# EAGLE design wifistation (EAGLE 9.6.2)
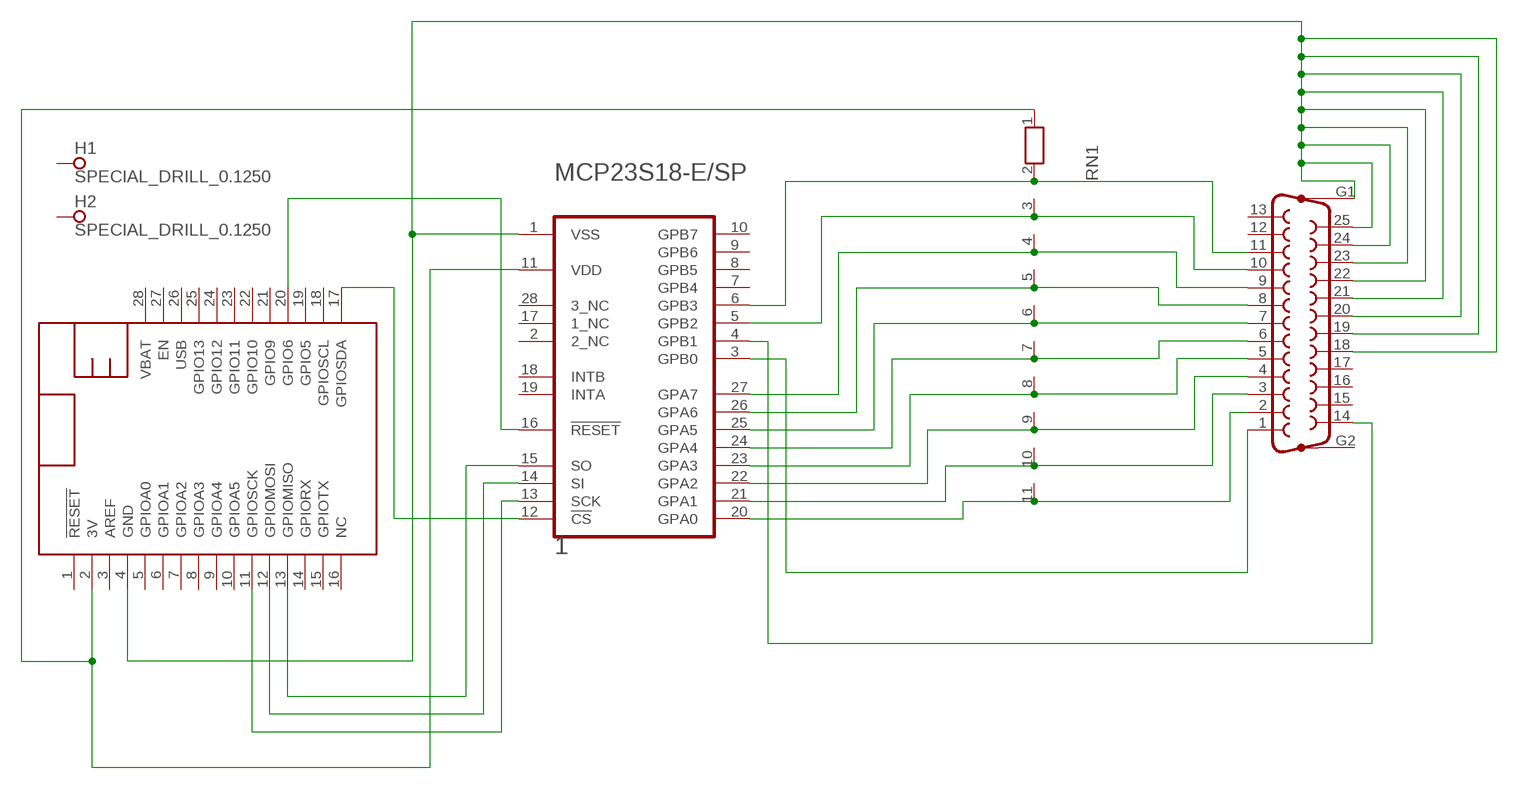
[diagram p0: schematic, sheet 1]

## Parts
1  MICROCHIP_MCP23S18-E-SPMICROCHIP_MCP23S18-E-SP_0_0  [MICROCHIP_MCP23S18-E-SP_0]
DB25  F25HP  [F25HP]
FEATHER  FEATHERWING_NODIM_NOHOLES  [FEATHERWING_DIM]
H1  SPECIAL_DRILL_0.1250  [PAD_0.1250]
H2  SPECIAL_DRILL_0.1250  [PAD_0.1250]
RN1  RN10  [RN-11]

## Nets
3V: 1.11(VDD) FEATHER.2(3V) RN1.1
ACK: 1.5(GPB2) DB25.10 RN1.3
BUSY: 1.6(GPB3) DB25.11 RN1.2
DATA0: 1.20(GPA0) DB25.2 RN1.11
DATA1: 1.21(GPA1) DB25.3 RN1.10
DATA2: 1.22(GPA2) DB25.4 RN1.9
DATA3: 1.23(GPA3) DB25.5 RN1.8
DATA4: 1.24(GPA4) DB25.6 RN1.7
DATA5: 1.25(GPA5) DB25.7 RN1.6
DATA6: 1.26(GPA6) DB25.8 RN1.5
DATA7: 1.27(GPA7) DB25.9 RN1.4
LINEFEED: 1.4(GPB1) DB25.14
N$1: 1.1(VSS) DB25.18 DB25.19 DB25.20 DB25.21 DB25.22 DB25.23 DB25.24 DB25.25 DB25.G1 FEATHER.4(GND)
N$2: 1.15(SO) FEATHER.13(GPIOMISO)
N$3: 1.16(!RESET!) FEATHER.20(GPIO6)
N$4: 1.14(SI) FEATHER.12(GPIOMOSI)
N$5: 1.13(SCK) FEATHER.11(GPIOSCK)
N$6: 1.12(!CS!) FEATHER.17(GPIOSDA)
STROBE: 1.3(GPB0) DB25.1
Unconnected: 1.2(2_NC) 1.7(GPB4) 1.8(GPB5) 1.9(GPB6) 1.10(GPB7) 1.17(1_NC) 1.18(INTB) 1.19(INTA) 1.28(3_NC) DB25.12 DB25.13 DB25.15 DB25.16 DB25.17 DB25.G2 FEATHER.1(!RESET) FEATHER.3(AREF) FEATHER.5(GPIOA0) FEATHER.6(GPIOA1) FEATHER.7(GPIOA2) FEATHER.8(GPIOA3) FEATHER.9(GPIOA4) FEATHER.10(GPIOA5) FEATHER.14(GPIORX) FEATHER.15(GPIOTX) FEATHER.16(NC) FEATHER.18(GPIOSCL) FEATHER.19(GPIO5) FEATHER.21(GPIO9) FEATHER.22(GPIO10) FEATHER.23(GPIO11) FEATHER.24(GPIO12) FEATHER.25(GPIO13) FEATHER.26(USB) FEATHER.27(EN) FEATHER.28(VBAT) H1.1 H2.1

## Library data of the parts
1 = SP:MICROCHIP_MCP23S18-E-SP: PR-BUSIC-MCP23S18-28; CIIVA_IDS: 1159082; COMPONENT_LINK_1_DESCRIPTION: Manufacturer URL; COMPONENT_LINK_1_URL: http://www.microchip.com/; COMPONENT_LINK_3_DESCRIPTION: Package Specification; COMPONENT_LINK_3_URL: http://www.microchip.com/stellent/groups/techpub_sg/documents/packagingspec/en012702.pdf; DATASHEET: http://ww1.microchip.com/downloads/en/DeviceDoc/22103a.pdf; DATASHEET_VERSION: revA, Sep-2008; FOOTPRINT_VARIANT_NAME_0: Manufacturer Recommended; IMPORTED: yes; IMPORTED_FROM: vault; IMPORT_TS: 1521846449; MF: Microchip; MPN: MCP23S18-E/SP; PACKAGE: SPDIP300-SP28; PACKAGE_DESCRIPTION: 28-Lead Skinny Plastic Dual In-Line (SP) - 300 mil Body [SPDIP]; PACKAGE_VERSION: revBB, Aug-2009; PREFIX: U; RELEASE_DATE: 1331953635; VAULT_GUID: 2D1A82E6-0393-4C19-9A39-33F9A78E4054; VAULT_REVISION: BF821639-BD4A-4B78-8582-77FD07E24365
DB25 = jcs:F25HP: SUB-D; OC_FARNELL: unknown; OC_NEWARK: unknown
FEATHER = jcs:FEATHERWING
H1 H2 = special-drill:SPECIAL_DRILL_: Special drills
RN1 = resistor-net:RN10: RESISTOR NETWORK; OC_FARNELL: unknown; OC_NEWARK: unknown

## Board
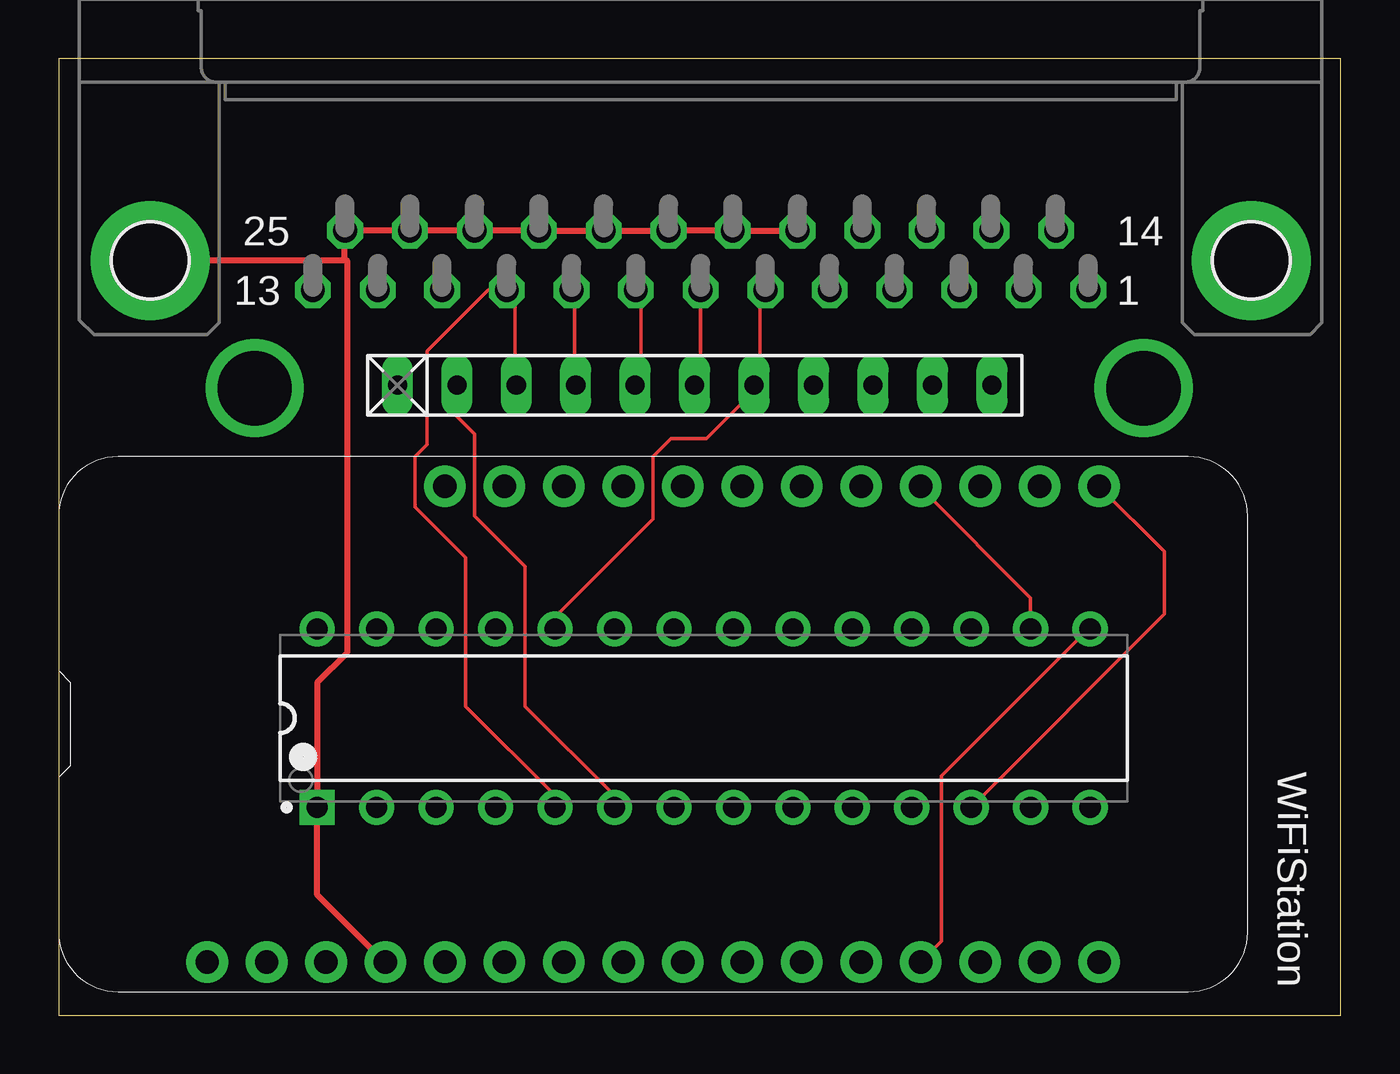
[diagram p1: board, top side]
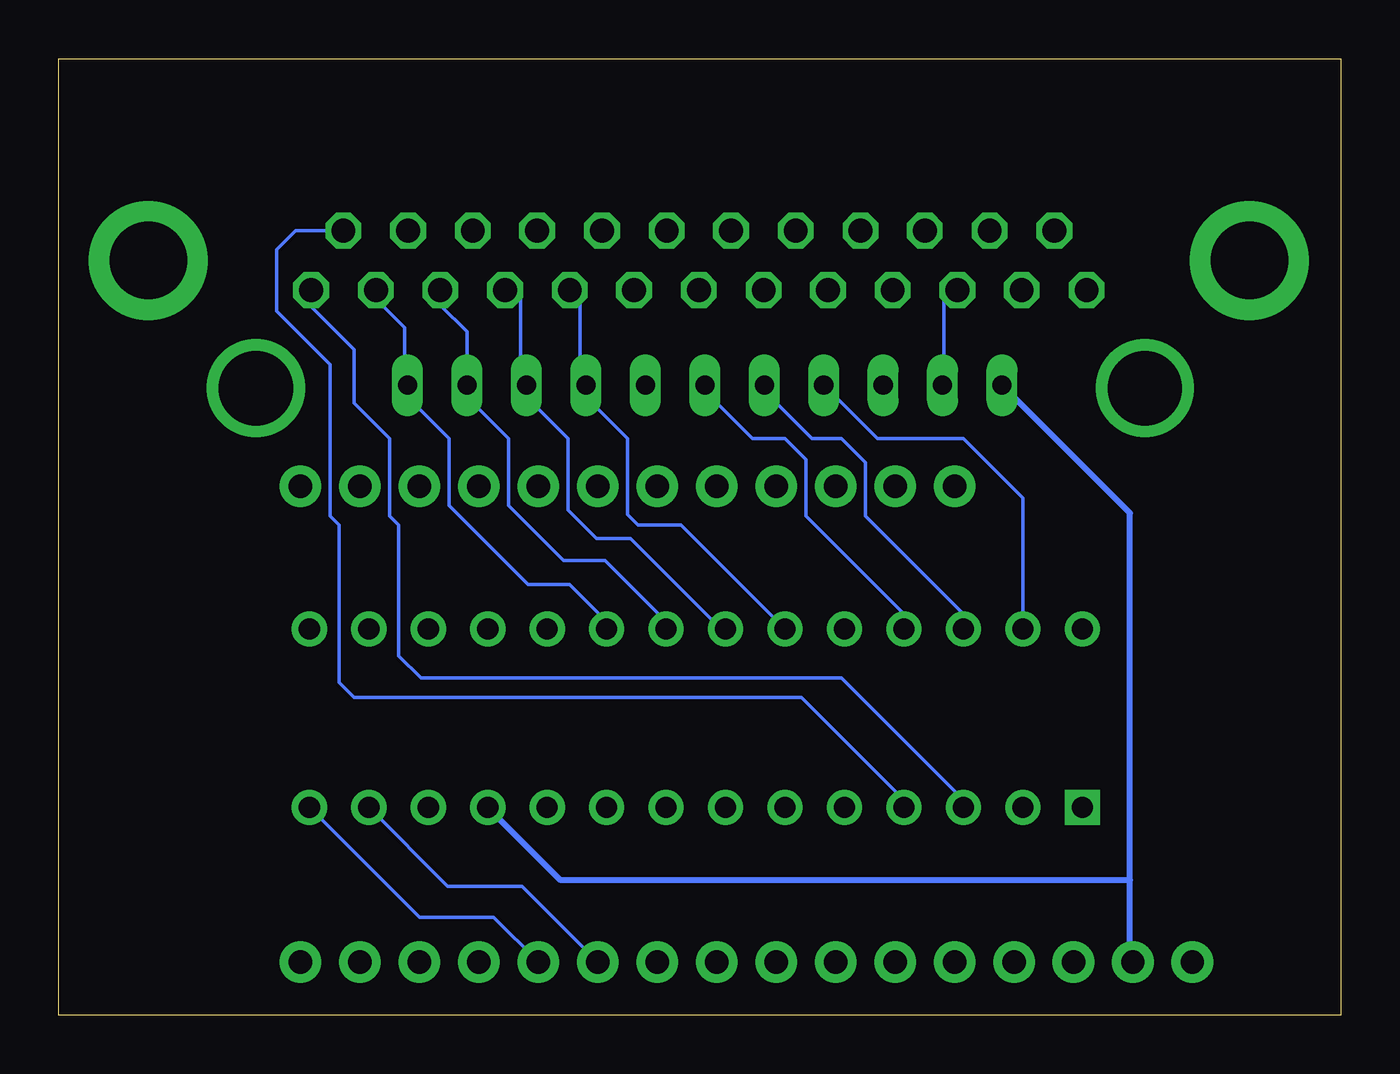
[diagram p2: board, bottom side, seen from below]

Size 54.79 x 40.88 mm. Coordinates in mm from the lower left corner, seen from the top.
Outline: 0,0 54.79,0 54.79,40.88 0,40.88 0,0
Copper layers (1*16): Top 0.035mm / dielectric 1.5mm / Bottom 0.035mm
Design rules "default": minimum track width 6mil, minimum drill 0.35mm, track to track 6mil, track to pad 6mil, pad to pad 6mil, via to via 6mil, smd to smd 6mil, copper to edge 40mil, drill to drill 6mil, minimum pad ring 10mil, minimum via ring 8mil, stop-mask expansion 4mil, vias tented up to drill 0mil, thermal gap 10mil

### Footprints (pad centres in the part's own frame; a part is rotated, then mirrored left to right if it is on the bottom)
MICROCHIP_MCP23S18-E-SP_0 = drill 0.9 pad 1.5 square: 1 -3.81,16.51 | drill 0.9 pad 1.5: 2 -3.81,13.97; 3 -3.81,11.43; 4 -3.81,8.89; 5 -3.81,6.35; 6 -3.81,3.81; 7 -3.81,1.27; 8 -3.81,-1.27; 9 -3.81,-3.81; 10 -3.81,-6.35; 11 -3.81,-8.89; 12 -3.81,-11.43; 13 -3.81,-13.97; 14 -3.81,-16.51; 15 3.81,-16.51; 16 3.81,-13.97; 17 3.81,-11.43; 18 3.81,-8.89; 19 3.81,-6.35; 20 3.81,-3.81; 21 3.81,-1.27; 22 3.81,1.27; 23 3.81,3.81; 24 3.81,6.35; 25 3.81,8.89; 26 3.81,11.43; 27 3.81,13.97; 28 3.81,16.51
F25HP = drill 1.016 octagon: 1 16.561,-1.27; 2 13.792,-1.27; 3 11.049,-1.27; 4 8.28,-1.27; 5 5.512,-1.27; 6 2.769,-1.27; 7 0,-1.27; 8 -2.769,-1.27; 9 -5.512,-1.27; 10 -8.28,-1.27; 11 -11.049,-1.27; 12 -13.792,-1.27; 13 -16.561,-1.27; 14 15.189,1.27; 15 12.421,1.27; 16 9.652,1.27; 17 6.909,1.27; 18 4.14,1.27; 19 1.372,1.27; 20 -1.372,1.27; 21 -4.14,1.27; 22 -6.909,1.27; 23 -9.652,1.27; 24 -12.421,1.27; 25 -15.189,1.27 | drill 3.302 pad 5.08: G1 -23.52,0; G2 23.52,0
FEATHERWING_DIM = drill 1 pad 1.778: 1 6.35,1.27; 2 8.89,1.27; 3 11.43,1.27; 4 13.97,1.27; 5 16.51,1.27; 6 19.05,1.27; 7 21.59,1.27; 8 24.13,1.27; 9 26.67,1.27; 10 29.21,1.27; 11 31.75,1.27; 12 34.29,1.27; 13 36.83,1.27; 14 39.37,1.27; 15 41.91,1.27; 16 44.45,1.27; 17 44.45,21.59; 18 41.91,21.59; 19 39.37,21.59; 20 36.83,21.59; 21 34.29,21.59; 22 31.75,21.59; 23 29.21,21.59; 24 26.67,21.59; 25 24.13,21.59; 26 21.59,21.59; 27 19.05,21.59; 28 16.51,21.59
PAD_0.1250 = drill 3.175 pad 3.175: 1 0,0
RN-11 = drill 0.813 long: 1 -12.7,0; 2 -10.16,0; 3 -7.62,0; 4 -5.08,0; 5 -2.54,0; 6 0,0; 7 2.54,0; 8 5.08,0; 9 7.62,0; 10 10.16,0; 11 12.7,0

### Placement (x,y rotation side)
1  27.56,12.7 90 top
DB25  27.43,32.26 0 top
FEATHER  0,1.02 0 top
H1  46.35,26.8 0 top
H2  8.38,26.8 0 top
RN1  27.18,26.92 0 top

### Tracks (layer width: path | path; a pad name or v marks a point on that pad's centre or on a via)
3V
  Bottom 0.152: 9.02,2.41 FEATHER.2
  Bottom 0.254: RN1.1 9.02,21.46 9.02,2.22 | 9.02,2.41 9.02,5.78 33.34,5.78 1.11
ACK
  Top 0.152: RN1.3 19.49,27.18 19.49,30.67 19.18,30.99 DB25.10 18.35,30.99 15.75,28.38 15.75,24.38 15.24,23.88 15.24,21.72 17.4,19.56 17.4,13.21 21.21,9.4 1.5
BUSY
  Top 0.152: 1.6 23.75,9.4 19.94,13.21 19.94,19.18 17.78,21.34 17.78,24.83 17.02,25.59 RN1.2
  Bottom 0.152: 17.14,27.05 RN1.2 16.95,27.18 16.95,30.99 DB25.11
DATA0
  Top 0.152: 1.20 31.37,16.64
  Bottom 0.152: DB25.2 41.22,30.61 40.01,29.39 40.01,27.05 RN1.11 39.88,26.42 38.1,24.64 38.1,21.78 34.73,18.41 32.96,18.41 31.37,16.83 1.20
DATA1
  Bottom 0.152: DB25.3 38.48,30.35 37.34,29.21 RN1.10 37.34,26.42 35.56,24.64 35.56,21.78 33.21,19.43 31.43,19.43 28.83,16.83 1.21
DATA2
  Bottom 0.152: DB25.4 35.05,30.99 35.05,27.18 RN1.9 34.8,26.42 33.02,24.64 33.02,21.59 31.81,20.38 30.35,20.38 26.48,16.51 1.22
DATA3
  Bottom 0.152: 33.15,30.99 DB25.5 32.51,30.99 32.51,27.18 RN1.8 32.51,26.67 30.48,24.64 30.48,21.4 30.03,20.96 28.19,20.96 1.23
DATA4
  Top 0.152: DB25.6 29.97,30.99 29.97,27.18 RN1.7 29.72,26.67 27.69,24.64 26.16,24.64 25.4,23.88 25.4,21.21 21.21,17.02 1.24
DATA5
  Top 0.152: DB25.7 27.43,27.18 RN1.6
  Bottom 0.152: 1.25 18.67,17.15 22.86,21.34 22.86,23.75 23.75,24.64 25.15,24.64 27.18,26.67 RN1.6
DATA6
  Top 0.152: RN1.5 24.89,27.18 24.89,30.99 DB25.8
  Bottom 0.152: 1.26 16.13,17.15 20.32,21.34 20.32,23.62 21.34,24.64 22.61,24.64 24.64,26.67 RN1.5
DATA7
  Top 0.152: RN1.4 22.04,27.18 22.04,30.99 DB25.9
  Bottom 0.152: 1.27 13.59,22.1 16.13,24.64 19.81,24.64 RN1.4
LINEFEED
  Bottom 0.152: 42.67,33.48 DB25.14 44.65,33.53 45.47,32.71 45.47,30.1 43.18,27.81 43.18,21.34 42.8,20.96 42.8,14.22 42.16,13.59 23.05,13.59 18.67,9.21 1.4
N$1
  Top 0.152: 13.78,2.41 FEATHER.4 | 12.19,33.53 DB25.25
  Top 0.254: 13.78,2.41 11.05,5.14 1.1 11.05,14.22 12.32,15.49 12.32,32.26 12.19,32.26 | DB25.18 DB25.19 DB25.20 DB25.21 DB25.22 DB25.23 DB25.24 DB25.25 | 12.19,33.53 12.19,32.26 | 12.19,32.26 DB25.G1
N$2
  Top 0.152: 1.15 44.01,16.51 37.72,10.22 37.72,3.18 FEATHER.13
N$3
  Top 0.152: 1.16 41.53,17.84 36.96,22.41 FEATHER.20
  Bottom 0.152: FEATHER.20 36.83,22.48
N$4
  Bottom 0.152: 1.14 39.37,4.19 36.2,4.19 FEATHER.12
N$5
  Bottom 0.152: 31.81,2.54 FEATHER.11 34.99,5.52 38.16,5.52 1.13
N$6
  Top 0.152: 1.12 47.24,17.15 47.24,19.81 FEATHER.17
STROBE
  Bottom 0.152: 1.3 16.13,9.21 21.34,14.41 39.31,14.41 40.26,15.37 40.26,20.96 40.64,21.34 40.64,24.64 42.16,26.16 42.16,28.45 43.99,30.28 DB25.1

### Text on the board
tPlace: WiFiStation